# EAGLE schematic schema (EAGLE 9.5.2)
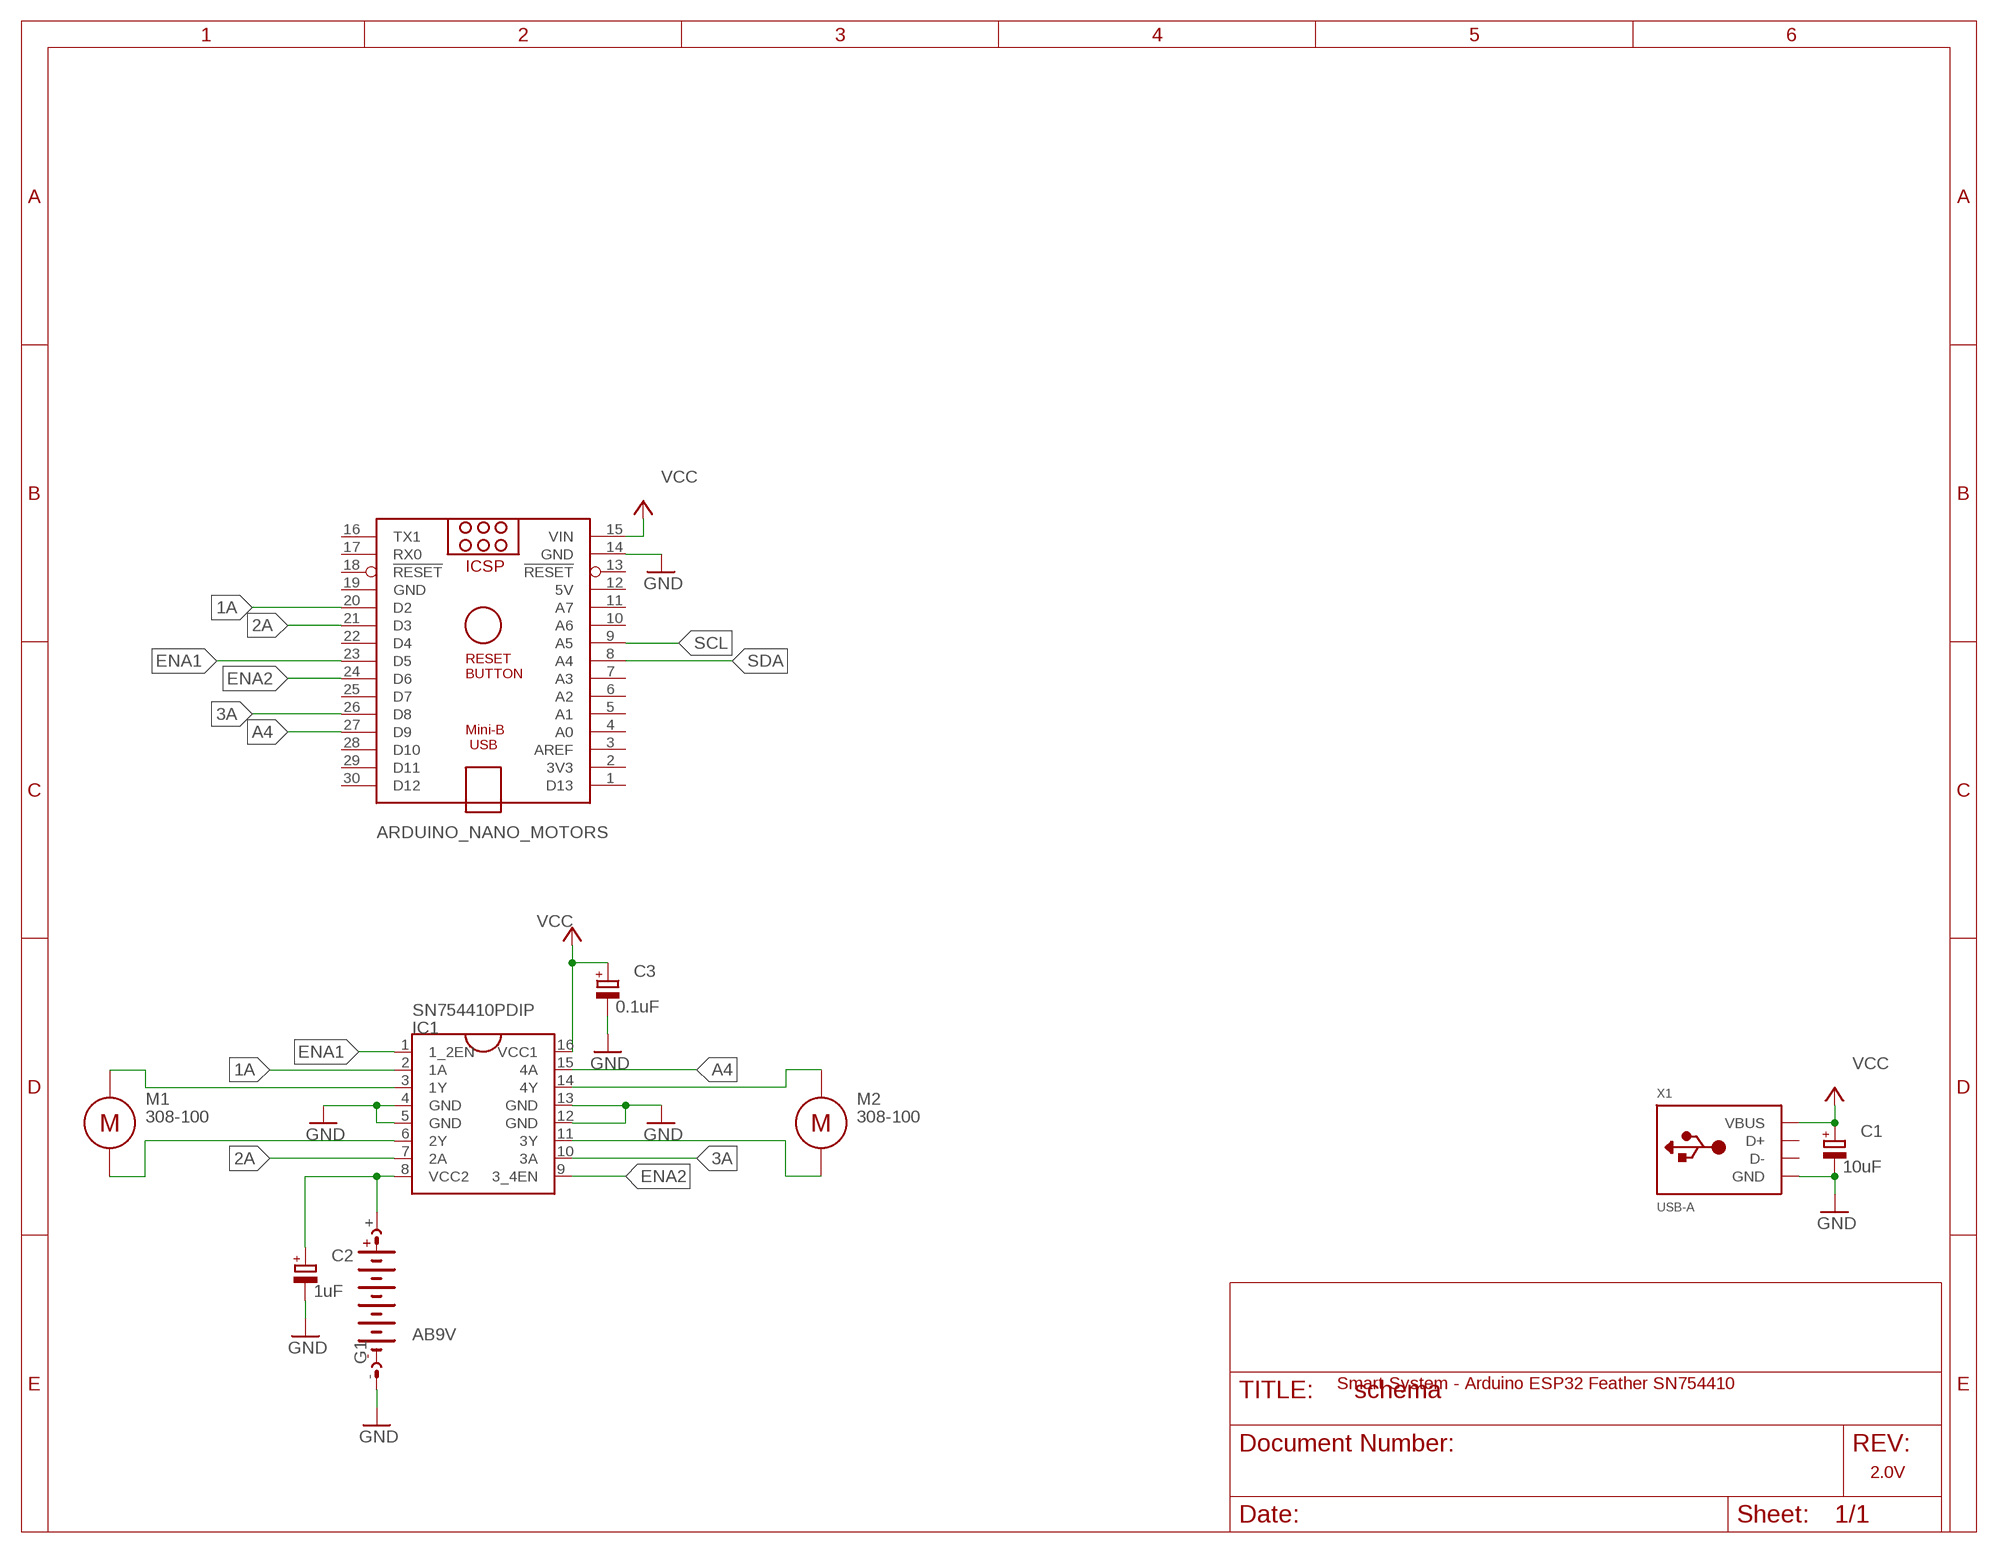
[diagram p0: schematic, sheet 1]

## Parts
ARDUINO_NANO_MOTORS  5  ARDUINO_NANO  [ARDUINO_NANO]
C1  10uF  CPOL-EUE3.5-8  [E3,5-8]
C2  1uF  CPOL-EUE3.5-8  [E3,5-8]
C3  0.1uF  CPOL-EUE3.5-8  [E3,5-8]
G1  AB9V  [AB9V]
IC1  SN754410PDIP  [DIL16]
M1  308-100  [308-100]
M2  308-100  [308-100]
X1  USB-A  [MOLEX_480371000]

## Nets
1A: ARDUINO_NANO_MOTORS.20(D2)
2A: ARDUINO_NANO_MOTORS.21(D3)
3A: ARDUINO_NANO_MOTORS.26(D8)
A4: ARDUINO_NANO_MOTORS.27(D9)
ENA1: ARDUINO_NANO_MOTORS.23(D5)
ENA2: ARDUINO_NANO_MOTORS.24(D6)
GND [New Class]: ARDUINO_NANO_MOTORS.14(GND) C1.- C2.- C3.- G1.- IC1.4(GND) IC1.5(GND) IC1.12(GND) IC1.13(GND) X1.4(GND)
N$1: IC1.1(1_2EN)
N$2: IC1.9(3_4EN)
N$3: IC1.2(1A)
N$4: IC1.7(2A)
N$5: IC1.3(1Y) M1.POS
N$6: IC1.10(3A)
N$7: C2.+ G1.+ IC1.8(VCC2)
N$8: IC1.15(4A)
N$9: IC1.6(2Y) M1.NEG
N$10: IC1.14(4Y) M2.POS
N$11: IC1.11(3Y) M2.NEG
SCL: ARDUINO_NANO_MOTORS.9(A5)
SDA: ARDUINO_NANO_MOTORS.8(A4)
VCC: ARDUINO_NANO_MOTORS.15(VIN) C1.+ C3.+ IC1.16(VCC1) X1.1(VBUS)
Unconnected: ARDUINO_NANO_MOTORS.1(D13) ARDUINO_NANO_MOTORS.2(3V3) ARDUINO_NANO_MOTORS.3(AREF) ARDUINO_NANO_MOTORS.4(A0) ARDUINO_NANO_MOTORS.5(A1) ARDUINO_NANO_MOTORS.6(A2) ARDUINO_NANO_MOTORS.7(A3) ARDUINO_NANO_MOTORS.10(A6) ARDUINO_NANO_MOTORS.11(A7) ARDUINO_NANO_MOTORS.13(!RESET) ARDUINO_NANO_MOTORS.16(TX1) ARDUINO_NANO_MOTORS.17(RX0) ARDUINO_NANO_MOTORS.18(!RESET) ARDUINO_NANO_MOTORS.22(D4) ARDUINO_NANO_MOTORS.25(D7) ARDUINO_NANO_MOTORS.28(D10) ARDUINO_NANO_MOTORS.29(D11) ARDUINO_NANO_MOTORS.30(D12) X1.2(D-) X1.3(D+)

## Notes on the sheet
- Smart System - Arduino ESP32 Feather SN754410
- 2.0V

## Power pins joined to a net without a drawn wire
5V: ARDUINO_NANO_MOTORS.12(5V)
GND: ARDUINO_NANO_MOTORS.19(GND)

## Library data of the parts
ARDUINO_NANO_MOTORS = ArduinoNanoV30:ARDUINO_NANO: Arduino Nano V3.0 Overview: The Arduino Nano is a small, complete, and breadboard-friendly board based on the ATmega328 (Arduino Nano 3.x) or ATmega168 (Arduino Nano 2.x). It has more or less the same functionality of the Arduino Duemilanove, but in a different package. It lacks only a DC power jack, and works with a Mini-B USB cable instead of a standard one. The Nano was designed and is being produced by Gravitech. Specifications: Microcontroller Atmel ATmega168 or ATmega328 Operating Voltage (logic level) 5 V Input Voltage (recommended) 7-12 V Input Voltage (limits) 6-20 V Digital I/O Pins 14 (of which 6 provide PWM output) Analog Input Pins 8 DC Current per I/O Pin 40 mA Flash Memory 16 KB (ATmega168) or 32 KB (ATmega328) of which 2 KB used by bootloader SRAM 1 KB (ATmega168) or 2 KB (ATmega328) EEPROM 512 bytes (ATmega168) or 1 KB (ATmega328) Clock Speed 16 MHz Dimensions 0.73" x 1.70" Length 45 mm Width 18 mm Weigth 5 g Power: The Arduino Nano can be powered via the Mini-B USB connection, 6-20V unregulated external power supply (pin 30), or 5V regulated external power supply (pin 27). The power source is automatically selected to the highest voltage source. Memory: The ATmega168 has 16 KB of flash memory for storing code (of which 2 KB is used for the bootloader); the ATmega328 has 32 KB, (also with 2 KB used for the bootloader). The ATmega168 has 1 KB of SRAM and 512 bytes of EEPROM (which can be read and written with the EEPROM library); the ATmega328 has 2 KB of SRAM and 1 KB of EEPROM. Input and Output: Each of the 14 digital pins on the Nano can be used as an input or output, using pinMode(), digitalWrite(), and digitalRead() functions. They operate at 5 volts. Each pin can provide or receive a maximum of 40 mA and has an internal pull-up resistor (disconnected by default) of 20-50 kOhms. In addition, some pins have specialized functions. Visit Arduino - ArduinoBoardNano <https://www.arduino.cc/en/Main/ArduinoBoardNano>
C1-C3 = rcl:CPOL-EU: POLARIZED CAPACITOR, European symbol; SPICEPREFIX: C
G1 = battery:AB9V: 9-V BATTERY CLIP
IC1 = AlexW-Eagle-Libraries:SN754410
M1 M2 = Motor:308-100: Pico Vibe 8mm Vibration Motor - 3mm Type; PRECISION_MICRODRIVES: 308-100
X1 = adafruit:USB-A: USB type A 'plug' Used for things that can directly connect to a USB port, say USB key